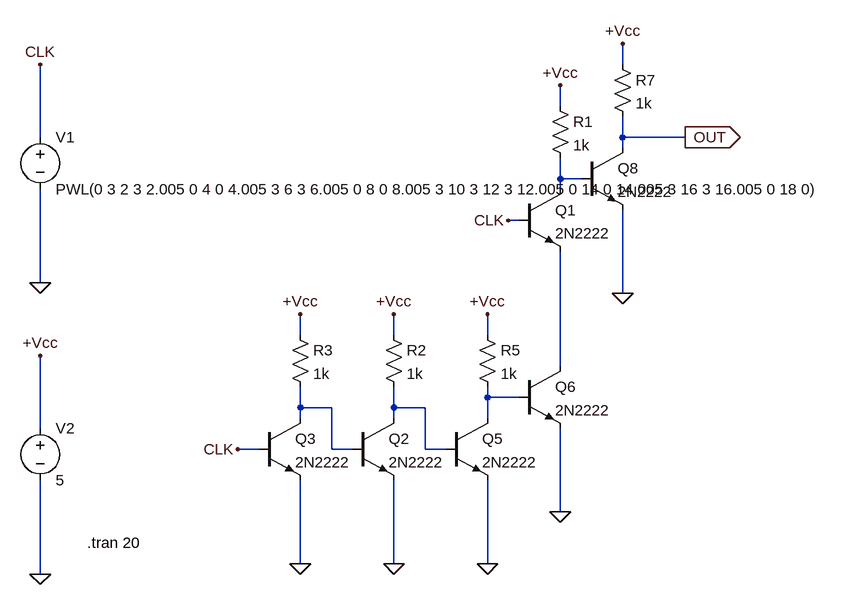
[diagram p0: schematic Rising Edge Detector.asc]
Rising Edge Detector.asc, the LTspice schematic file:
Version 4
SHEET 1 1116 752
WIRE 704 -48 704 -80
WIRE 608 16 608 -16
WIRE -192 64 -192 -48
WIRE 704 64 704 32
WIRE 800 64 704 64
WIRE 704 80 704 64
WIRE 608 128 608 96
WIRE 640 128 608 128
WIRE 608 144 608 128
WIRE 544 192 528 192
WIRE -192 288 -192 144
WIRE 704 304 704 176
WIRE 208 368 208 336
WIRE 352 368 352 336
WIRE 496 368 496 336
WIRE 608 416 608 240
WIRE 496 464 496 448
WIRE 544 464 496 464
WIRE 208 480 208 448
WIRE 256 480 208 480
WIRE 352 480 352 448
WIRE 400 480 352 480
WIRE 208 496 208 480
WIRE 352 496 352 480
WIRE 496 496 496 464
WIRE -192 512 -192 400
WIRE 144 544 112 544
WIRE 256 544 256 480
WIRE 288 544 256 544
WIRE 400 544 400 480
WIRE 432 544 400 544
WIRE 608 640 608 512
WIRE 208 720 208 592
WIRE 352 720 352 592
WIRE 496 720 496 592
WIRE -192 736 -192 592
FLAG 608 -16 +Vcc
FLAG 352 720 0
FLAG 352 336 +Vcc
FLAG 208 720 0
FLAG 208 336 +Vcc
FLAG 496 720 0
FLAG 496 336 +Vcc
FLAG 608 640 0
FLAG 704 304 0
FLAG 704 -80 +Vcc
FLAG 800 64 OUT
IOPIN 800 64 Out
FLAG -192 -48 CLK
FLAG -192 288 0
FLAG -192 400 +Vcc
FLAG -192 736 0
FLAG 112 544 CLK
FLAG 528 192 CLK
SYMBOL npn 544 144 R0
SYMATTR InstName Q1
SYMATTR Value 2N2222
SYMBOL Res 592 0 R0
SYMATTR InstName R1
SYMATTR Value 1k
SYMBOL npn 288 496 R0
SYMATTR InstName Q2
SYMATTR Value 2N2222
SYMBOL Res 336 352 R0
SYMATTR InstName R2
SYMATTR Value 1k
SYMBOL npn 144 496 R0
SYMATTR InstName Q3
SYMATTR Value 2N2222
SYMBOL Res 192 352 R0
SYMATTR InstName R3
SYMATTR Value 1k
SYMBOL npn 432 496 R0
SYMATTR InstName Q5
SYMATTR Value 2N2222
SYMBOL Res 480 352 R0
SYMATTR InstName R5
SYMATTR Value 1k
SYMBOL npn 544 416 R0
SYMATTR InstName Q6
SYMATTR Value 2N2222
SYMBOL npn 640 80 R0
SYMATTR InstName Q8
SYMATTR Value 2N2222
SYMBOL Res 688 -64 R0
SYMATTR InstName R7
SYMATTR Value 1k
SYMBOL voltage -192 48 R0
SYMATTR InstName V1
SYMATTR Value PWL(0 3 2 3 2.005 0 4 0 4.005 3 6 3 6.005 0 8 0 8.005 3 10 3 12 3 12.005 0 14 0 14.005 3 16 3 16.005 0 18 0)
SYMBOL voltage -192 496 R0
SYMATTR InstName V2
SYMATTR Value 5
TEXT -120 688 Left 2 !.tran 20

The netlist it stands for:
* Rising Edge Detector.asc
Q1 N001 CLK N002 0 2N2222
R1 +Vcc N001 1k
Q2 N005 N004 0 0 2N2222
R2 +Vcc N005 1k
Q3 N004 CLK 0 0 2N2222
R3 +Vcc N004 1k
Q5 N003 N005 0 0 2N2222
R5 +Vcc N003 1k
Q6 N002 N003 0 0 2N2222
Q8 OUT N001 0 0 2N2222
R7 +Vcc OUT 1k
V1 CLK 0 PWL(0 3 2 3 2.005 0 4 0 4.005 3 6 3 6.005 0 8 0 8.005 3 10 3 12 3 12.005 0 14 0 14.005 3 16 3 16.005 0 18 0)
V2 +Vcc 0 5
.model NPN NPN
.model PNP PNP
.lib standard.bjt
.tran 20
.backanno
.end